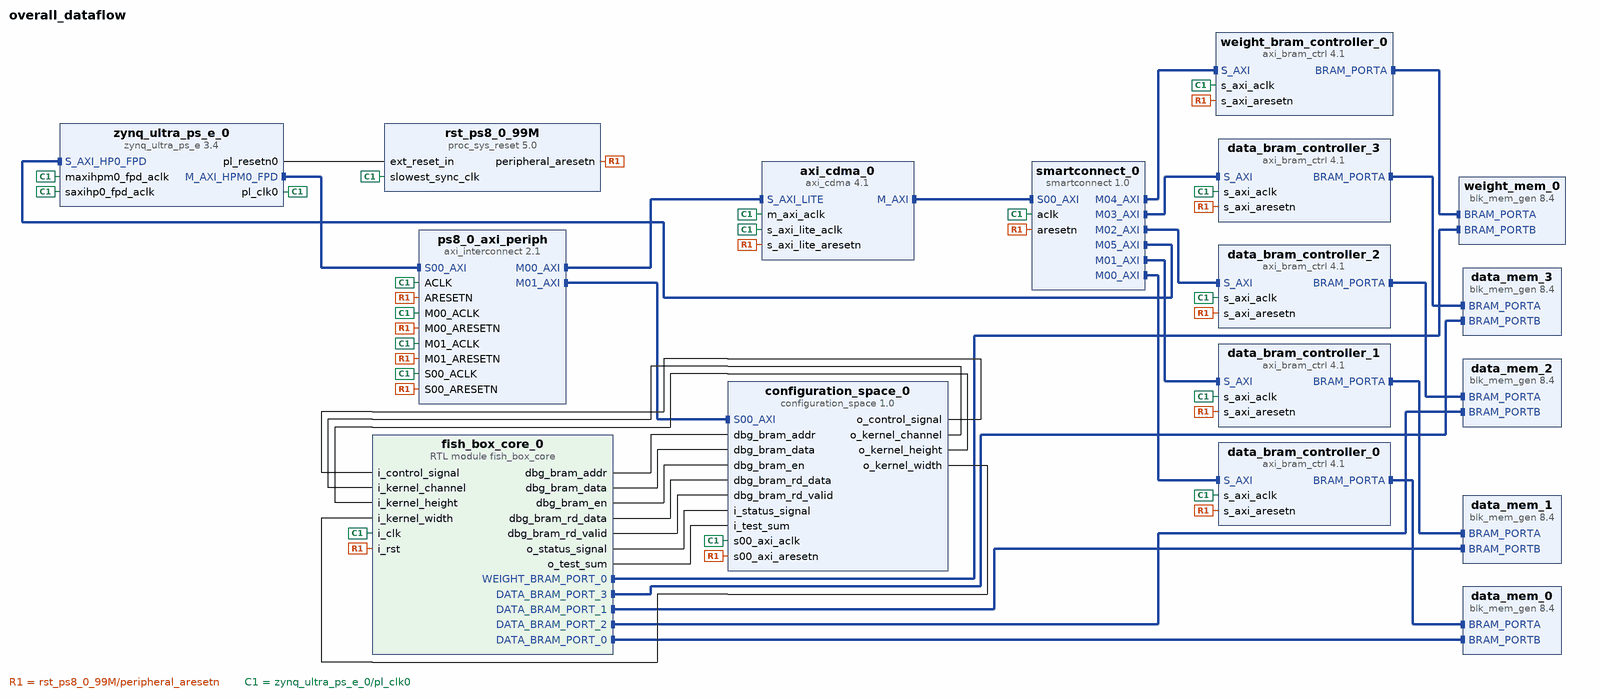
[diagram p0: block diagram of the top level]
# Vivado block design overall_dataflow, xck26-sfvc784-2LV-c, Vivado 2022.2
create_bd_design overall_dataflow

create_bd_cell -type ip -vlnv xilinx.com:ip:zynq_ultra_ps_e:3.4 zynq_ultra_ps_e_0
set_property -dict [list \
  CONFIG.PSU_BANK_0_IO_STANDARD LVCMOS18 \
  CONFIG.PSU_BANK_1_IO_STANDARD LVCMOS18 \
  CONFIG.PSU_BANK_2_IO_STANDARD LVCMOS18 \
  CONFIG.PSU_BANK_3_IO_STANDARD LVCMOS18 \
  CONFIG.PSU__CAN1__PERIPHERAL__ENABLE 0 \
  CONFIG.PSU__CRF_APB__ACPU_CTRL__FREQMHZ 1333.333 \
  CONFIG.PSU__CRF_APB__ACPU_CTRL__SRCSEL APLL \
  CONFIG.PSU__CRF_APB__APLL_CTRL__SRCSEL PSS_REF_CLK \
  CONFIG.PSU__CRF_APB__APLL_FRAC_CFG__ENABLED 1 \
  CONFIG.PSU__CRF_APB__DBG_FPD_CTRL__FREQMHZ 250 \
  CONFIG.PSU__CRF_APB__DBG_FPD_CTRL__SRCSEL IOPLL \
  CONFIG.PSU__CRF_APB__DBG_TRACE_CTRL__FREQMHZ 250 \
  CONFIG.PSU__CRF_APB__DBG_TRACE_CTRL__SRCSEL IOPLL \
  CONFIG.PSU__CRF_APB__DBG_TSTMP_CTRL__FREQMHZ 250 \
  CONFIG.PSU__CRF_APB__DBG_TSTMP_CTRL__SRCSEL IOPLL \
  CONFIG.PSU__CRF_APB__DDR_CTRL__FREQMHZ 1200 \
  CONFIG.PSU__CRF_APB__DDR_CTRL__SRCSEL DPLL \
  CONFIG.PSU__CRF_APB__DPDMA_REF_CTRL__FREQMHZ 600 \
  CONFIG.PSU__CRF_APB__DPDMA_REF_CTRL__SRCSEL APLL \
  CONFIG.PSU__CRF_APB__DPLL_CTRL__SRCSEL PSS_REF_CLK \
  CONFIG.PSU__CRF_APB__GDMA_REF_CTRL__FREQMHZ 600 \
  CONFIG.PSU__CRF_APB__GDMA_REF_CTRL__SRCSEL DPLL \
  CONFIG.PSU__CRF_APB__GPU_REF_CTRL__FREQMHZ 600 \
  CONFIG.PSU__CRF_APB__GPU_REF_CTRL__SRCSEL IOPLL \
  CONFIG.PSU__CRF_APB__TOPSW_LSBUS_CTRL__FREQMHZ 100 \
  CONFIG.PSU__CRF_APB__TOPSW_LSBUS_CTRL__SRCSEL IOPLL \
  CONFIG.PSU__CRF_APB__TOPSW_MAIN_CTRL__FREQMHZ 533.33 \
  CONFIG.PSU__CRF_APB__TOPSW_MAIN_CTRL__SRCSEL DPLL \
  CONFIG.PSU__CRF_APB__VPLL_CTRL__SRCSEL PSS_REF_CLK \
  CONFIG.PSU__CRL_APB__ADMA_REF_CTRL__FREQMHZ 500 \
  CONFIG.PSU__CRL_APB__ADMA_REF_CTRL__SRCSEL IOPLL \
  CONFIG.PSU__CRL_APB__CAN1_REF_CTRL__SRCSEL IOPLL \
  CONFIG.PSU__CRL_APB__CPU_R5_CTRL__FREQMHZ 533.333 \
  CONFIG.PSU__CRL_APB__CPU_R5_CTRL__SRCSEL RPLL \
  CONFIG.PSU__CRL_APB__DBG_LPD_CTRL__FREQMHZ 250 \
  CONFIG.PSU__CRL_APB__DBG_LPD_CTRL__SRCSEL IOPLL \
  CONFIG.PSU__CRL_APB__I2C1_REF_CTRL__FREQMHZ 100 \
  CONFIG.PSU__CRL_APB__I2C1_REF_CTRL__SRCSEL IOPLL \
  CONFIG.PSU__CRL_APB__IOPLL_CTRL__SRCSEL PSS_REF_CLK \
  CONFIG.PSU__CRL_APB__IOU_SWITCH_CTRL__FREQMHZ 250 \
  CONFIG.PSU__CRL_APB__IOU_SWITCH_CTRL__SRCSEL IOPLL \
  CONFIG.PSU__CRL_APB__LPD_LSBUS_CTRL__FREQMHZ 100 \
  CONFIG.PSU__CRL_APB__LPD_LSBUS_CTRL__SRCSEL IOPLL \
  CONFIG.PSU__CRL_APB__LPD_SWITCH_CTRL__FREQMHZ 500 \
  CONFIG.PSU__CRL_APB__LPD_SWITCH_CTRL__SRCSEL IOPLL \
  CONFIG.PSU__CRL_APB__PCAP_CTRL__FREQMHZ 200 \
  CONFIG.PSU__CRL_APB__PCAP_CTRL__SRCSEL IOPLL \
  CONFIG.PSU__CRL_APB__PL0_REF_CTRL__FREQMHZ 100 \
  CONFIG.PSU__CRL_APB__PL0_REF_CTRL__SRCSEL IOPLL \
  CONFIG.PSU__CRL_APB__PL1_REF_CTRL__SRCSEL IOPLL \
  CONFIG.PSU__CRL_APB__QSPI_REF_CTRL__FREQMHZ 125 \
  CONFIG.PSU__CRL_APB__QSPI_REF_CTRL__SRCSEL IOPLL \
  CONFIG.PSU__CRL_APB__RPLL_CTRL__SRCSEL PSS_REF_CLK \
  CONFIG.PSU__CRL_APB__SPI1_REF_CTRL__SRCSEL IOPLL \
  CONFIG.PSU__CRL_APB__TIMESTAMP_REF_CTRL__FREQMHZ 100 \
  CONFIG.PSU__CRL_APB__TIMESTAMP_REF_CTRL__SRCSEL IOPLL \
  CONFIG.PSU__CSUPMU__PERIPHERAL__VALID 1 \
  CONFIG.PSU__DDRC__BUS_WIDTH {64 Bit} \
  CONFIG.PSU__DDRC__COMPONENTS Components \
  CONFIG.PSU__DDRC__DEVICE_CAPACITY {8192 MBits} \
  CONFIG.PSU__DDRC__DRAM_WIDTH {16 Bits} \
  CONFIG.PSU__DDRC__ECC Disabled \
  CONFIG.PSU__DDRC__MEMORY_TYPE {DDR 4} \
  CONFIG.PSU__DDRC__SPEED_BIN DDR4_2400R \
  CONFIG.PSU__DDR_HIGH_ADDRESS_GUI_ENABLE 1 \
  CONFIG.PSU__DDR__INTERFACE__FREQMHZ 600.000 \
  CONFIG.PSU__FPGA_PL0_ENABLE 1 \
  CONFIG.PSU__FPGA_PL1_ENABLE 1 \
  CONFIG.PSU__GPIO0_MIO__IO {MIO 0 .. 25} \
  CONFIG.PSU__GPIO0_MIO__PERIPHERAL__ENABLE 1 \
  CONFIG.PSU__GPIO1_MIO__IO {MIO 26 .. 51} \
  CONFIG.PSU__GPIO1_MIO__PERIPHERAL__ENABLE 1 \
  CONFIG.PSU__I2C0__PERIPHERAL__ENABLE 0 \
  CONFIG.PSU__I2C1__PERIPHERAL__ENABLE 1 \
  CONFIG.PSU__I2C1__PERIPHERAL__IO {MIO 24 .. 25} \
  CONFIG.PSU__IOU_SLCR__IOU_TTC_APB_CLK__TTC0_SEL APB \
  CONFIG.PSU__IOU_SLCR__IOU_TTC_APB_CLK__TTC1_SEL APB \
  CONFIG.PSU__IOU_SLCR__IOU_TTC_APB_CLK__TTC2_SEL APB \
  CONFIG.PSU__IOU_SLCR__IOU_TTC_APB_CLK__TTC3_SEL APB \
  CONFIG.PSU__MAXIGP0__DATA_WIDTH 128 \
  CONFIG.PSU__OVERRIDE__BASIC_CLOCK 0 \
  CONFIG.PSU__PMU_COHERENCY 0 \
  CONFIG.PSU__PMU__AIBACK__ENABLE 0 \
  CONFIG.PSU__PMU__EMIO_GPI__ENABLE 0 \
  CONFIG.PSU__PMU__EMIO_GPO__ENABLE 0 \
  CONFIG.PSU__PMU__GPI0__ENABLE 1 \
  CONFIG.PSU__PMU__GPI0__IO {MIO 26} \
  CONFIG.PSU__PMU__GPI1__ENABLE 0 \
  CONFIG.PSU__PMU__GPI2__ENABLE 0 \
  CONFIG.PSU__PMU__GPI3__ENABLE 0 \
  CONFIG.PSU__PMU__GPI4__ENABLE 0 \
  CONFIG.PSU__PMU__GPI5__ENABLE 1 \
  CONFIG.PSU__PMU__GPI5__IO {MIO 31} \
  CONFIG.PSU__PMU__GPO0__ENABLE 0 \
  CONFIG.PSU__PMU__GPO1__ENABLE 0 \
  CONFIG.PSU__PMU__GPO2__ENABLE 0 \
  CONFIG.PSU__PMU__GPO3__ENABLE 1 \
  CONFIG.PSU__PMU__GPO3__IO {MIO 35} \
  CONFIG.PSU__PMU__GPO3__POLARITY low \
  CONFIG.PSU__PMU__GPO4__ENABLE 0 \
  CONFIG.PSU__PMU__GPO5__ENABLE 0 \
  CONFIG.PSU__PMU__PERIPHERAL__ENABLE 1 \
  CONFIG.PSU__PMU__PLERROR__ENABLE 0 \
  CONFIG.PSU__PRESET_APPLIED 1 \
  CONFIG.PSU__PSS_REF_CLK__FREQMHZ 33.333 \
  CONFIG.PSU__QSPI_COHERENCY 0 \
  CONFIG.PSU__QSPI_ROUTE_THROUGH_FPD 0 \
  CONFIG.PSU__QSPI__GRP_FBCLK__ENABLE 0 \
  CONFIG.PSU__QSPI__PERIPHERAL__DATA_MODE x4 \
  CONFIG.PSU__QSPI__PERIPHERAL__ENABLE 1 \
  CONFIG.PSU__QSPI__PERIPHERAL__IO {MIO 0 .. 5} \
  CONFIG.PSU__QSPI__PERIPHERAL__MODE Single \
  CONFIG.PSU__SPI1__GRP_SS0__IO {MIO 9} \
  CONFIG.PSU__SPI1__PERIPHERAL__ENABLE 1 \
  CONFIG.PSU__SPI1__PERIPHERAL__IO {MIO 6 .. 11} \
  CONFIG.PSU__SWDT0__CLOCK__ENABLE 0 \
  CONFIG.PSU__SWDT0__PERIPHERAL__ENABLE 1 \
  CONFIG.PSU__SWDT0__RESET__ENABLE 0 \
  CONFIG.PSU__SWDT1__CLOCK__ENABLE 0 \
  CONFIG.PSU__SWDT1__PERIPHERAL__ENABLE 1 \
  CONFIG.PSU__SWDT1__RESET__ENABLE 0 \
  CONFIG.PSU__TTC0__CLOCK__ENABLE 0 \
  CONFIG.PSU__TTC0__PERIPHERAL__ENABLE 1 \
  CONFIG.PSU__TTC0__WAVEOUT__ENABLE 0 \
  CONFIG.PSU__TTC1__CLOCK__ENABLE 0 \
  CONFIG.PSU__TTC1__PERIPHERAL__ENABLE 1 \
  CONFIG.PSU__TTC1__WAVEOUT__ENABLE 0 \
  CONFIG.PSU__TTC2__CLOCK__ENABLE 0 \
  CONFIG.PSU__TTC2__PERIPHERAL__ENABLE 1 \
  CONFIG.PSU__TTC2__WAVEOUT__ENABLE 0 \
  CONFIG.PSU__TTC3__CLOCK__ENABLE 0 \
  CONFIG.PSU__TTC3__PERIPHERAL__ENABLE 1 \
  CONFIG.PSU__TTC3__WAVEOUT__ENABLE 0 \
  CONFIG.PSU__USE__IRQ0 1 \
  CONFIG.PSU__USE__M_AXI_GP0 1 \
  CONFIG.PSU__USE__M_AXI_GP1 0 \
  CONFIG.PSU__USE__M_AXI_GP2 0 \
  CONFIG.PSU__USE__S_AXI_GP2 1 \
] [get_bd_cells zynq_ultra_ps_e_0]
# 240 more settings of zynq_ultra_ps_e_0 are not shown: defaults, MIO pin electricals, DDR timing, and values the tool derives
create_bd_cell -type ip -vlnv xilinx.com:ip:axi_cdma:4.1 axi_cdma_0
set_property -dict {CONFIG.C_INCLUDE_SG 0} [get_bd_cells axi_cdma_0]
create_bd_cell -type ip -vlnv xilinx.com:ip:smartconnect:1.0 smartconnect_0
set_property -dict {CONFIG.NUM_MI 6 CONFIG.NUM_SI 1} [get_bd_cells smartconnect_0]
create_bd_cell -type ip -vlnv xilinx.com:ip:proc_sys_reset:5.0 rst_ps8_0_99M
create_bd_cell -type ip -vlnv xilinx.com:ip:axi_interconnect:2.1 ps8_0_axi_periph
set_property -dict {CONFIG.NUM_MI 2 CONFIG.NUM_SI 1} [get_bd_cells ps8_0_axi_periph]
create_bd_cell -type ip -vlnv xilinx.com:ip:axi_bram_ctrl:4.1 data_bram_controller_1
set_property -dict {CONFIG.SINGLE_PORT_BRAM 1} [get_bd_cells data_bram_controller_1]
create_bd_cell -type ip -vlnv xilinx.com:ip:axi_bram_ctrl:4.1 data_bram_controller_3
set_property -dict {CONFIG.SINGLE_PORT_BRAM 1} [get_bd_cells data_bram_controller_3]
create_bd_cell -type ip -vlnv xilinx.com:ip:blk_mem_gen:8.4 data_mem_2
set_property -dict [list \
  CONFIG.Assume_Synchronous_Clk true \
  CONFIG.Memory_Type True_Dual_Port_RAM \
  CONFIG.Write_Depth_A 102400 \
  CONFIG.use_bram_block Stand_Alone \
] [get_bd_cells data_mem_2]
create_bd_cell -type ip -vlnv xilinx.com:ip:blk_mem_gen:8.4 data_mem_3
set_property -dict [list \
  CONFIG.Assume_Synchronous_Clk true \
  CONFIG.Memory_Type True_Dual_Port_RAM \
  CONFIG.Write_Depth_A 102400 \
  CONFIG.use_bram_block Stand_Alone \
] [get_bd_cells data_mem_3]
create_bd_cell -type ip -vlnv xilinx.com:ip:axi_bram_ctrl:4.1 weight_bram_controller_0
set_property -dict {CONFIG.SINGLE_PORT_BRAM 1} [get_bd_cells weight_bram_controller_0]
create_bd_cell -type ip -vlnv xilinx.com:ip:blk_mem_gen:8.4 weight_mem_0
set_property -dict [list \
  CONFIG.Assume_Synchronous_Clk true \
  CONFIG.Memory_Type True_Dual_Port_RAM \
  CONFIG.Write_Depth_A 102400 \
  CONFIG.use_bram_block Stand_Alone \
] [get_bd_cells weight_mem_0]
create_bd_cell -type ip -vlnv xilinx.com:ip:axi_bram_ctrl:4.1 data_bram_controller_2
set_property -dict {CONFIG.SINGLE_PORT_BRAM 1} [get_bd_cells data_bram_controller_2]
create_bd_cell -type ip -vlnv xilinx.com:ip:blk_mem_gen:8.4 data_mem_0
set_property -dict [list \
  CONFIG.Assume_Synchronous_Clk true \
  CONFIG.Memory_Type True_Dual_Port_RAM \
  CONFIG.Write_Depth_A 102400 \
  CONFIG.use_bram_block Stand_Alone \
] [get_bd_cells data_mem_0]
create_bd_cell -type ip -vlnv xilinx.com:ip:axi_bram_ctrl:4.1 data_bram_controller_0
set_property -dict {CONFIG.SINGLE_PORT_BRAM 1} [get_bd_cells data_bram_controller_0]
create_bd_cell -type ip -vlnv xilinx.com:ip:blk_mem_gen:8.4 data_mem_1
set_property -dict [list \
  CONFIG.Assume_Synchronous_Clk true \
  CONFIG.Memory_Type True_Dual_Port_RAM \
  CONFIG.Write_Depth_A 102400 \
  CONFIG.use_bram_block Stand_Alone \
] [get_bd_cells data_mem_1]
create_bd_cell -type ip -vlnv xilinx.com:user:configuration_space:1.0 configuration_space_0
create_bd_cell -type module -reference fish_box_core fish_box_core_0

# ---- connections ----

connect_bd_intf_net -intf_net axi_bram_ctrl_0_BRAM_PORTA [get_bd_intf_pins data_mem_0/BRAM_PORTA] [get_bd_intf_pins data_bram_controller_0/BRAM_PORTA]
connect_bd_intf_net [get_bd_intf_pins axi_cdma_0/M_AXI] [get_bd_intf_pins smartconnect_0/S00_AXI]
connect_bd_intf_net [get_bd_intf_pins data_bram_controller_1/BRAM_PORTA] [get_bd_intf_pins data_mem_1/BRAM_PORTA]
connect_bd_intf_net [get_bd_intf_pins data_bram_controller_2/BRAM_PORTA] [get_bd_intf_pins data_mem_2/BRAM_PORTA]
connect_bd_intf_net [get_bd_intf_pins data_bram_controller_3/BRAM_PORTA] [get_bd_intf_pins data_mem_3/BRAM_PORTA]
connect_bd_intf_net [get_bd_intf_pins data_mem_0/BRAM_PORTB] [get_bd_intf_pins fish_box_core_0/DATA_BRAM_PORT_0]
connect_bd_intf_net [get_bd_intf_pins data_mem_1/BRAM_PORTB] [get_bd_intf_pins fish_box_core_0/DATA_BRAM_PORT_1]
connect_bd_intf_net [get_bd_intf_pins data_mem_2/BRAM_PORTB] [get_bd_intf_pins fish_box_core_0/DATA_BRAM_PORT_2]
connect_bd_intf_net [get_bd_intf_pins data_mem_3/BRAM_PORTB] [get_bd_intf_pins fish_box_core_0/DATA_BRAM_PORT_3]
connect_bd_intf_net [get_bd_intf_pins weight_mem_0/BRAM_PORTB] [get_bd_intf_pins fish_box_core_0/WEIGHT_BRAM_PORT_0]
connect_bd_intf_net [get_bd_intf_pins ps8_0_axi_periph/M00_AXI] [get_bd_intf_pins axi_cdma_0/S_AXI_LITE]
connect_bd_intf_net [get_bd_intf_pins configuration_space_0/S00_AXI] [get_bd_intf_pins ps8_0_axi_periph/M01_AXI]
connect_bd_intf_net [get_bd_intf_pins smartconnect_0/M00_AXI] [get_bd_intf_pins data_bram_controller_0/S_AXI]
connect_bd_intf_net [get_bd_intf_pins smartconnect_0/M01_AXI] [get_bd_intf_pins data_bram_controller_1/S_AXI]
connect_bd_intf_net [get_bd_intf_pins smartconnect_0/M02_AXI] [get_bd_intf_pins data_bram_controller_2/S_AXI]
connect_bd_intf_net [get_bd_intf_pins smartconnect_0/M03_AXI] [get_bd_intf_pins data_bram_controller_3/S_AXI]
connect_bd_intf_net [get_bd_intf_pins smartconnect_0/M04_AXI] [get_bd_intf_pins weight_bram_controller_0/S_AXI]
connect_bd_intf_net [get_bd_intf_pins smartconnect_0/M05_AXI] [get_bd_intf_pins zynq_ultra_ps_e_0/S_AXI_HP0_FPD]
connect_bd_intf_net [get_bd_intf_pins weight_bram_controller_0/BRAM_PORTA] [get_bd_intf_pins weight_mem_0/BRAM_PORTA]
connect_bd_intf_net [get_bd_intf_pins zynq_ultra_ps_e_0/M_AXI_HPM0_FPD] [get_bd_intf_pins ps8_0_axi_periph/S00_AXI]
connect_bd_net [get_bd_pins configuration_space_0/o_control_signal] [get_bd_pins fish_box_core_0/i_control_signal]
connect_bd_net [get_bd_pins configuration_space_0/o_kernel_channel] [get_bd_pins fish_box_core_0/i_kernel_channel]
connect_bd_net [get_bd_pins configuration_space_0/o_kernel_height] [get_bd_pins fish_box_core_0/i_kernel_height]
connect_bd_net [get_bd_pins configuration_space_0/o_kernel_width] [get_bd_pins fish_box_core_0/i_kernel_width]
connect_bd_net [get_bd_pins fish_box_core_0/dbg_bram_addr] [get_bd_pins configuration_space_0/dbg_bram_addr]
connect_bd_net [get_bd_pins fish_box_core_0/dbg_bram_data] [get_bd_pins configuration_space_0/dbg_bram_data]
connect_bd_net [get_bd_pins fish_box_core_0/dbg_bram_en] [get_bd_pins configuration_space_0/dbg_bram_en]
connect_bd_net [get_bd_pins fish_box_core_0/dbg_bram_rd_data] [get_bd_pins configuration_space_0/dbg_bram_rd_data]
connect_bd_net [get_bd_pins fish_box_core_0/dbg_bram_rd_valid] [get_bd_pins configuration_space_0/dbg_bram_rd_valid]
connect_bd_net [get_bd_pins fish_box_core_0/o_status_signal] [get_bd_pins configuration_space_0/i_status_signal]
connect_bd_net [get_bd_pins fish_box_core_0/o_test_sum] [get_bd_pins configuration_space_0/i_test_sum]
connect_bd_net [get_bd_pins rst_ps8_0_99M/peripheral_aresetn] \
  [get_bd_pins smartconnect_0/aresetn] [get_bd_pins ps8_0_axi_periph/S00_ARESETN] [get_bd_pins axi_cdma_0/s_axi_lite_aresetn] \
  [get_bd_pins ps8_0_axi_periph/M00_ARESETN] [get_bd_pins ps8_0_axi_periph/ARESETN] \
  [get_bd_pins data_bram_controller_1/s_axi_aresetn] [get_bd_pins data_bram_controller_3/s_axi_aresetn] \
  [get_bd_pins weight_bram_controller_0/s_axi_aresetn] [get_bd_pins data_bram_controller_2/s_axi_aresetn] \
  [get_bd_pins data_bram_controller_0/s_axi_aresetn] [get_bd_pins ps8_0_axi_periph/M01_ARESETN] \
  [get_bd_pins configuration_space_0/s00_axi_aresetn] [get_bd_pins fish_box_core_0/i_rst]
connect_bd_net [get_bd_pins zynq_ultra_ps_e_0/pl_clk0] \
  [get_bd_pins axi_cdma_0/m_axi_aclk] [get_bd_pins smartconnect_0/aclk] [get_bd_pins rst_ps8_0_99M/slowest_sync_clk] \
  [get_bd_pins zynq_ultra_ps_e_0/maxihpm0_fpd_aclk] [get_bd_pins ps8_0_axi_periph/S00_ACLK] \
  [get_bd_pins axi_cdma_0/s_axi_lite_aclk] [get_bd_pins ps8_0_axi_periph/M00_ACLK] [get_bd_pins ps8_0_axi_periph/ACLK] \
  [get_bd_pins data_bram_controller_1/s_axi_aclk] [get_bd_pins data_bram_controller_3/s_axi_aclk] \
  [get_bd_pins weight_bram_controller_0/s_axi_aclk] [get_bd_pins data_bram_controller_2/s_axi_aclk] \
  [get_bd_pins data_bram_controller_0/s_axi_aclk] [get_bd_pins ps8_0_axi_periph/M01_ACLK] \
  [get_bd_pins zynq_ultra_ps_e_0/saxihp0_fpd_aclk] [get_bd_pins configuration_space_0/s00_axi_aclk] \
  [get_bd_pins fish_box_core_0/i_clk]
connect_bd_net [get_bd_pins zynq_ultra_ps_e_0/pl_resetn0] [get_bd_pins rst_ps8_0_99M/ext_reset_in]

# ---- address map ----
assign_bd_address -offset 0x00000000 -range 2G -target_address_space [get_bd_addr_spaces axi_cdma_0/Data] [get_bd_addr_segs zynq_ultra_ps_e_0/SAXIGP2/HP0_DDR_LOW]
assign_bd_address -offset 0xC0000000 -range 512M -target_address_space [get_bd_addr_spaces axi_cdma_0/Data] [get_bd_addr_segs zynq_ultra_ps_e_0/SAXIGP2/HP0_QSPI]
assign_bd_address -offset 0xE0000000 -range 8K -target_address_space [get_bd_addr_spaces axi_cdma_0/Data] [get_bd_addr_segs data_bram_controller_0/S_AXI/Mem0]
assign_bd_address -offset 0xE0002000 -range 8K -target_address_space [get_bd_addr_spaces axi_cdma_0/Data] [get_bd_addr_segs data_bram_controller_1/S_AXI/Mem0]
assign_bd_address -offset 0xE0004000 -range 8K -target_address_space [get_bd_addr_spaces axi_cdma_0/Data] [get_bd_addr_segs data_bram_controller_2/S_AXI/Mem0]
assign_bd_address -offset 0xE0006000 -range 8K -target_address_space [get_bd_addr_spaces axi_cdma_0/Data] [get_bd_addr_segs data_bram_controller_3/S_AXI/Mem0]
assign_bd_address -offset 0xE0008000 -range 8K -target_address_space [get_bd_addr_spaces axi_cdma_0/Data] [get_bd_addr_segs weight_bram_controller_0/S_AXI/Mem0]
exclude_bd_addr_seg -offset 0x00000000 -range 1 -target_address_space [get_bd_addr_spaces axi_cdma_0/Data] [get_bd_addr_segs zynq_ultra_ps_e_0/SAXIGP2/HP0_DDR_HIGH]
exclude_bd_addr_seg -offset 0xFF000000 -range 16M -target_address_space [get_bd_addr_spaces axi_cdma_0/Data] [get_bd_addr_segs zynq_ultra_ps_e_0/SAXIGP2/HP0_LPS_OCM]
assign_bd_address -offset 0xC0000000 -range 8K -target_address_space [get_bd_addr_spaces axi_cdma_0/Data_SG] [get_bd_addr_segs data_bram_controller_0/S_AXI/Mem0]
assign_bd_address -offset 0x00A0000000 -range 64K -target_address_space [get_bd_addr_spaces zynq_ultra_ps_e_0/Data] [get_bd_addr_segs axi_cdma_0/S_AXI_LITE/Reg]
assign_bd_address -offset 0x00A0010000 -range 64K -target_address_space [get_bd_addr_spaces zynq_ultra_ps_e_0/Data] [get_bd_addr_segs configuration_space_0/S00_AXI/S00_AXI_reg]

validate_bd_design
save_bd_design
